# Altium schematic sheet MainBoard_V100_CON.SchDoc
size A4; SheetNumber: 9; SheetTotal: 22; Title_: Connector
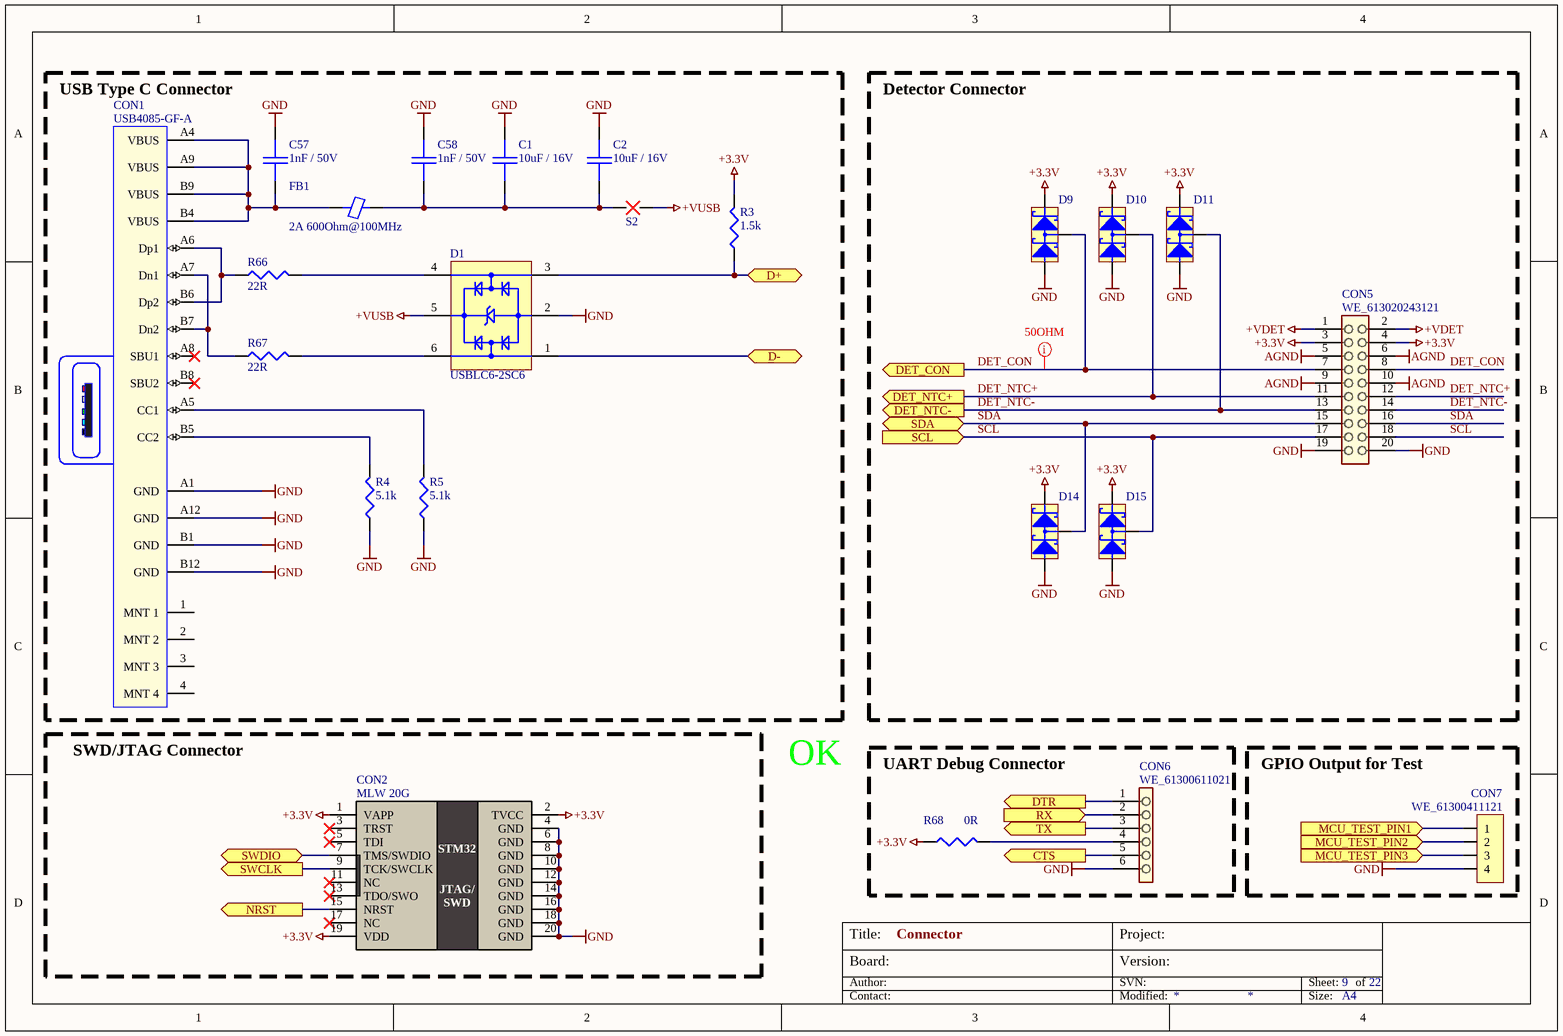
[diagram p0: MainBoard_V100_CON.SchDoc]

## Parts
C1  10uF / 16V  [0805_C]
C2  10uF / 16V  [0805_C]
C57  1nF / 50V  [0805_C]
C58  1nF / 50V  [0805_C]
CON1  USB4085-GF-A  [FP-USB4085-GF-A-MFG]
CON2  MLW 20G  [CON_MLW20G_TH]
CON5  WE_613020243121  [CON_HEADER20_2ROW_2.54_90DEG]
CON6  WE_61300611021  [WE_61300611021]
CON7  WE_61300411121  [CON4_SIMPLE_TH]
D1  USBLC6-2SC6  [SOT-23-6L]
D9  BAS70-04  [SOT-23]  (value not drawn)
D10  BAS70-04  [SOT-23]  (value not drawn)
D11  BAS70-04  [SOT-23]  (value not drawn)
D14  BAS70-04  [SOT-23]  (value not drawn)
D15  BAS70-04  [SOT-23]  (value not drawn)
FB1  2A 600Ohm@100MHz  [0805_FB]
R3  1.5k  [0805]
R4  5.1k  [0805]
R5  5.1k  [0805]
R66  22R  [0603]
R67  22R  [0603]
R68  0R  [0805]
S2  SPLITER  [SPLITER2_30mil_9mil]  (value not drawn)  (no BOM)

## Blocks framed on the sheet
USB Type C Connector: C1 C2 C57 C58 CON1 D1 FB1 R3-R5 R66 R67 S2
Detector Connector: CON5 D9-D11 D14 D15
SWD/JTAG Connector: CON2
UART Debug Connector: CON6 R68
GPIO Output for Test: CON7

## Ports
CTS (out), D+ (bidir), D- (bidir), DET_CON (out), DET_NTC+ (out), DET_NTC- (out), DTR (out), MCU_TEST_PIN1 (in), MCU_TEST_PIN2 (in), MCU_TEST_PIN3 (in), NRST (out), RX (in), SCL (in), SDA (bidir), SWCLK (out), SWDIO (bidir), TX (out)

## Nets
+3.3V: CON2.1(VAPP) CON2.2(TVCC) CON2.19(VDD) CON5.3 CON5.4 D9.2 D10.2 D11.2 D14.2 D15.2 R3.2 R68.1
+VDET: CON5.1 CON5.2
+VUSB: D1.5(VBUS) S2.2
AGND: CON5.5 CON5.6 CON5.9 CON5.10
GND: C1.1 C2.1 C57.2 C58.2 CON1.A1(GND) CON1.A12(GND) CON1.B1(GND) CON1.B12(GND) CON2.4(GND) CON2.6(GND) CON2.8(GND) CON2.10(GND) CON2.12(GND) CON2.14(GND) CON2.16(GND) CON2.18(GND) CON2.20(GND) CON5.19 CON5.20 CON6.6 CON7.4 D1.2(GND) D9.1 D10.1 D11.1 D14.1 D15.1 R4.1 R5.1
CTS: CON6.5 ; port CTS
D+: D1.3(I/O_2) R3.1 ; port D+
D-: D1.1(I/O_1) ; port D-
DET_CON: CON5.7 CON5.8 D9.3 ; port DET_CON
DET_NTC+: CON5.11 CON5.12 D10.3 ; port DET_NTC+
DET_NTC-: CON5.13 CON5.14 D11.3 ; port DET_NTC-
DTR: CON6.1 ; port DTR
MCU_TEST_PIN1: CON7.1 ; port MCU_TEST_PIN1
MCU_TEST_PIN2: CON7.2 ; port MCU_TEST_PIN2
MCU_TEST_PIN3: CON7.3 ; port MCU_TEST_PIN3
NRST: CON2.15(NRST) ; port NRST
RX: CON6.2 ; port RX
SCL: CON5.17 CON5.18 D15.3 ; port SCL
SDA: CON5.15 CON5.16 D14.3 ; port SDA
SWCLK: CON2.9(TCK/SWCLK) ; port SWCLK
SWDIO: CON2.7(TMS/SWDIO) ; port SWDIO
TX: CON6.3 ; port TX
NetC1_2: C1.2 C2.2 C58.1 FB1.1 S2.1
NetC57_1: C57.1 CON1.A4(VBUS) CON1.A9(VBUS) CON1.B4(VBUS) CON1.B9(VBUS) FB1.2
NetCON1_A5: CON1.A5(CC1) R5.2
NetCON1_A6: CON1.A6(Dp1) CON1.B6(Dp2) R66.1
NetCON1_A7: CON1.A7(Dn1) CON1.B7(Dn2) R67.1
NetCON1_B5: CON1.B5(CC2) R4.2
NetCON6_4: CON6.4 R68.2
NetD1_4: D1.4(I/O_3) R66.2
NetD1_6: D1.6(I/O_4) R67.2

Not connected (* = marked no-connect by the designer): CON1 1(MNT_1) 2(MNT_2) 3(MNT_3) 4(MNT_4) A8(SBU1)* B8(SBU2)*; CON2 3(TRST)* 5(TDI)* 11(NC)* 13(TDO/SWO)* 17(NC)*

## Layout directives
net class 50R: DET_CON

## Notes on the sheet
- OK
- Board:
- Author:
- Title:
- Project:
- SVN:
- Version:
- Sheet:
- of
- Contact:
- Modified:
- Size:
- A4
- (in symbol 203) STM32; JTAG/; SWD

## Library data of the parts
C1 C2 = 153: 10uF 16V X5R; Part Number: SMD0805-10uF-16V; Azonosító: 153; Category: Passives; Subcategory: PASS_Capacitor; Supplier 1: HESTORE; Supplier 1 order number: 100.344.52
C57 C58 = 144: 1nF 50V X7R; Part Number: SMD0805-1nF-50V; Azonosító: 144; Category: Passives; Subcategory: PASS_Capacitor; Supplier 1: HESTORE; Supplier 1 order number: 100.200.70
CON1 = 308: USB Type C,USB 2.0, Rec,THT,  5A, 48V; USB Standard: USB 2.0; Azonosító: 308; Gender: Receptacle; Number of Positions: 16; Category: Connectors; Contact Material: Copper Alloy; Part Number: USB4085-GF-A; Subcategory: CONN_Board-to-Wire; Supplier 1: MOUSER; Supplier 1 order number: 640-USB4085-GF-A; Supplier 2: FARNELL; Supplier 2 order number: 2924867; Help URL: https://hu.mouser.com/datasheet/2/837/GCT_usb4085-3240028.pdf; Orientation: Right Angle; Contact Plating: Gold
CON2 = 203: JTAG/SWD Connector for ST-LINK/V2, 20pole; Part Number: JTAG/SWD ST-LINK/V2 20pole; Azonosító: 203; Category: Connectors; Subcategory: CONN_Board-to-Wire; Supplier 1: MOUSER; Supplier 1 order number: 710-61202021621; Supplier 2: RET; Supplier 2 order number: 53-12-88
CON5 = 395: Board-To-Board Connector, 90DEG, 2.54 mm, 2x10 Contacts, Header, WR-PHD Series, Through Hole; Azonosító: 395; Part Number: 613020243121; Category: Connectors; Subcategory: ELME_Other; Supplier 1: MOUSER; Supplier 1 order number: 710-613020243121; Help URL: https://www.we-online.com/components/products/datasheet/613020243121.pdf; System: Connector
CON6 = 397: Board-To-Board Connector, 90 DEG, 2.54 mm, 6 Contacts, Header, WR-PHD Series, Through Hole; Azonosító: 397; Part Number: 61300611021; Category: Connectors; Subcategory: ELME_Other; Supplier 1: MOUSER; Supplier 1 order number: 710-61300611021; Help URL: https://www.we-online.com/components/products/datasheet/61300611021.pdf
CON7 = 250: Board-To-Board Connector, Vertical, 2.54 mm, 4 Contacts, Header, WR-PHD Series, Through Hole; Part Number: Pin Header 04 Pole 1 Row 2.54mm; Azonosító: 250; Category: Connectors; Subcategory: CONN_Board-to-Board; Supplier 1: MOUSER; Supplier 1 order number: 710-61300411121; Supplier 2: FARNELL; Supplier 2 order number: 2356155
D1 = 341: Very low capacitance ESD protection, 3.5 pF, -40 to 125 degC, 6-Pin SOT23; Manufacturer: STMicroelectronics; Polarity: Uni-Directional; Clamping Voltage: 17V; Rad Hardened: No; Product Height (mm): 1.3mm; Leakage Current (Max): 0.15uA; Product Length (mm): 3.05mm; Number of Elements: 1; Peak Pulse Current: 5A; Configuration: Dual; Reverse Breakdown Voltage: 6V; Working Voltage (Max): 5V; Capacitance Value: 3.5pF; Suppressor Type: DiodeArrays; Product Depth (mm): 1.75mm; Test Current (It): 1mA; Azonosító: 341; Package / Case: SOT-23; Operating Temperature Max Deg. C: 125C; Package Description: 6-Pin Small Outline Transistor, Body 2.925 x 1.625 mm, Pitch 0.95 mm; Package Reference: SOT23-6L; Datasheet Version: Rev. 5, 10/2011; Operating Temperature Min Deg. C: -40C; Mounting Style: SurfaceMount; Direction Type: Uni-Directional; Mounting: SurfaceMount; Pin Count: 6; Leakage Current: 0.15uA; Packaging: TapeandReel; Operating Temperature Classification: Automotive; Clamping Voltage (Max): 17V; Manufacturer URL: http://www.st.com/; Reverse Stand-off Voltage: 5V; Datasheet URL: http://www.st.com/st-web-ui/static/active/en/resource/technical/document/datasheet/CD00050750.pdf; Working Voltage: 5V; Operating Temp Range: -40Cto125C; Part Number: USBLC6-2SC6; Category: Integrated Circuits; Subcategory: SEMI_TVS; Supplier 1: MOUSER; Supplier 1 order number: 511-USBLC6-2SC6; Supplier 2: FARNELL; Supplier 2 order number: 1269406; Help URL: https://hu.mouser.com/datasheet/2/389/usblc6_2-1852789.pdf
D9-D11 D14 D15 = 191: Small Signal Schottky Diode, Dual Series, 70 V, 15 mA, 1 V, 100 mA, 150 °C; Part Number: BAS70-04LT1G; Azonosító: 191; Category: Semiconductors; Subcategory: SEMI_Schottky Array; Supplier 1: MOUSER; Supplier 1 order number: 771-BAS70-04-QR; Supplier 2: FARNELL; Supplier 2 order number: 1431108; Help URL: https://hu.mouser.com/datasheet/2/916/BAS70_04_Q-2937484.pdf
FB1 = 183: Ferrite bead 2A 600Ohm@100MHz; Part Number: LCBB-601 SMD; Azonosító: 183; Category: Passives; Subcategory: PASS_Other; Supplier 1: HESTORE; Supplier 1 order number: 100.327.86
R3 = 379: 1.5k 0805 0.125W 1%; Part Number: SMD0805-1.5k-1%; Azonosító: 379; Category: Passives; Subcategory: PASS_Resistor; Supplier 1: HESTORE; Supplier 1 order number: 100.327.80
R4 R5 = 378: 5.1k 0805 0.125W 5%; Part Number: SMD0805-5.1k 5%; Azonosító: 378; Category: Passives; Subcategory: PASS_Resistor; Supplier 1: HESTORE; Supplier 1 order number: 100.013.49
R66 R67 = 10: 22R 0603 0.1W 5%; Part Number: SMD0603-22R-5%; Azonosító: 10; Category: Passives; Subcategory: PASS_Resistor; Supplier 1: HESTORE; Supplier 1 order number: 100.239.27; Help URL: https://www.hestore.hu/prod_getfile.php?id=306
R68 = 38: 0R 0805 0.125W 5%; Part Number: 0 R 5%; Azonosító: 38; Category: Passives; Subcategory: PASS_Resistor; Supplier 1: HESTORE; Supplier 1 order number: 100.275.70
S2 = 272: SPLITER2_30mil_9mil; Azonosító: 272; Part Number: SPLITER2_30mil_9mil; Category: Accessories; Subcategory: ACCE_Other